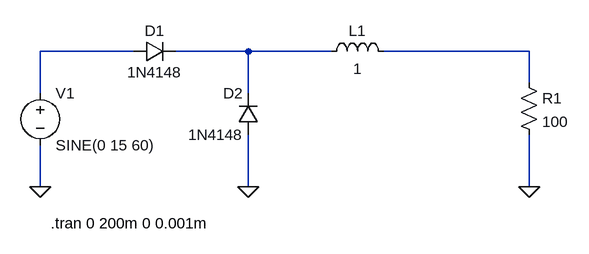
[diagram p0: schematic rectificador_monofásico_meia-onda_LR_com diodo de roda livre.asc]
rectificador_monofásico_meia-onda_LR_com diodo de roda livre.asc, the LTspice schematic file:
Version 4
SHEET 1 880 680
WIRE 192 80 48 80
WIRE 368 80 256 80
WIRE 496 80 368 80
WIRE 800 80 576 80
WIRE 800 128 800 80
WIRE 48 144 48 80
WIRE 368 144 368 80
WIRE 48 288 48 224
WIRE 368 288 368 208
WIRE 800 288 800 208
FLAG 48 288 0
FLAG 800 288 0
FLAG 368 288 0
SYMBOL voltage 48 128 R0
WINDOW 123 0 0 Left 0
WINDOW 39 0 0 Left 0
SYMATTR InstName V1
SYMATTR Value SINE(0 15 60)
SYMBOL diode 192 96 R270
WINDOW 0 32 32 VTop 2
WINDOW 3 0 32 VBottom 2
SYMATTR InstName D1
SYMATTR Value 1N4148
SYMBOL res 784 112 R0
SYMATTR InstName R1
SYMATTR Value 100
SYMBOL ind 480 96 R270
WINDOW 0 32 56 VTop 2
WINDOW 3 5 56 VBottom 2
SYMATTR InstName L1
SYMATTR Value 1
SYMBOL diode 384 208 R180
WINDOW 0 24 64 Left 2
WINDOW 3 24 0 Left 2
SYMATTR InstName D2
SYMATTR Value 1N4148
TEXT 64 344 Left 2 !.tran 0 200m 0 0.001m

The netlist it stands for:
* rectificador_monofásico_meia-onda_LR_com diodo de roda livre.asc
V1 N001 0 SINE(0 15 60)
D1 N001 N002 1N4148
R1 N003 0 100
L1 N002 N003 1
D2 0 N002 1N4148
.model D D
.lib standard.dio
.tran 0 200m 0 0.001m
.backanno
.end